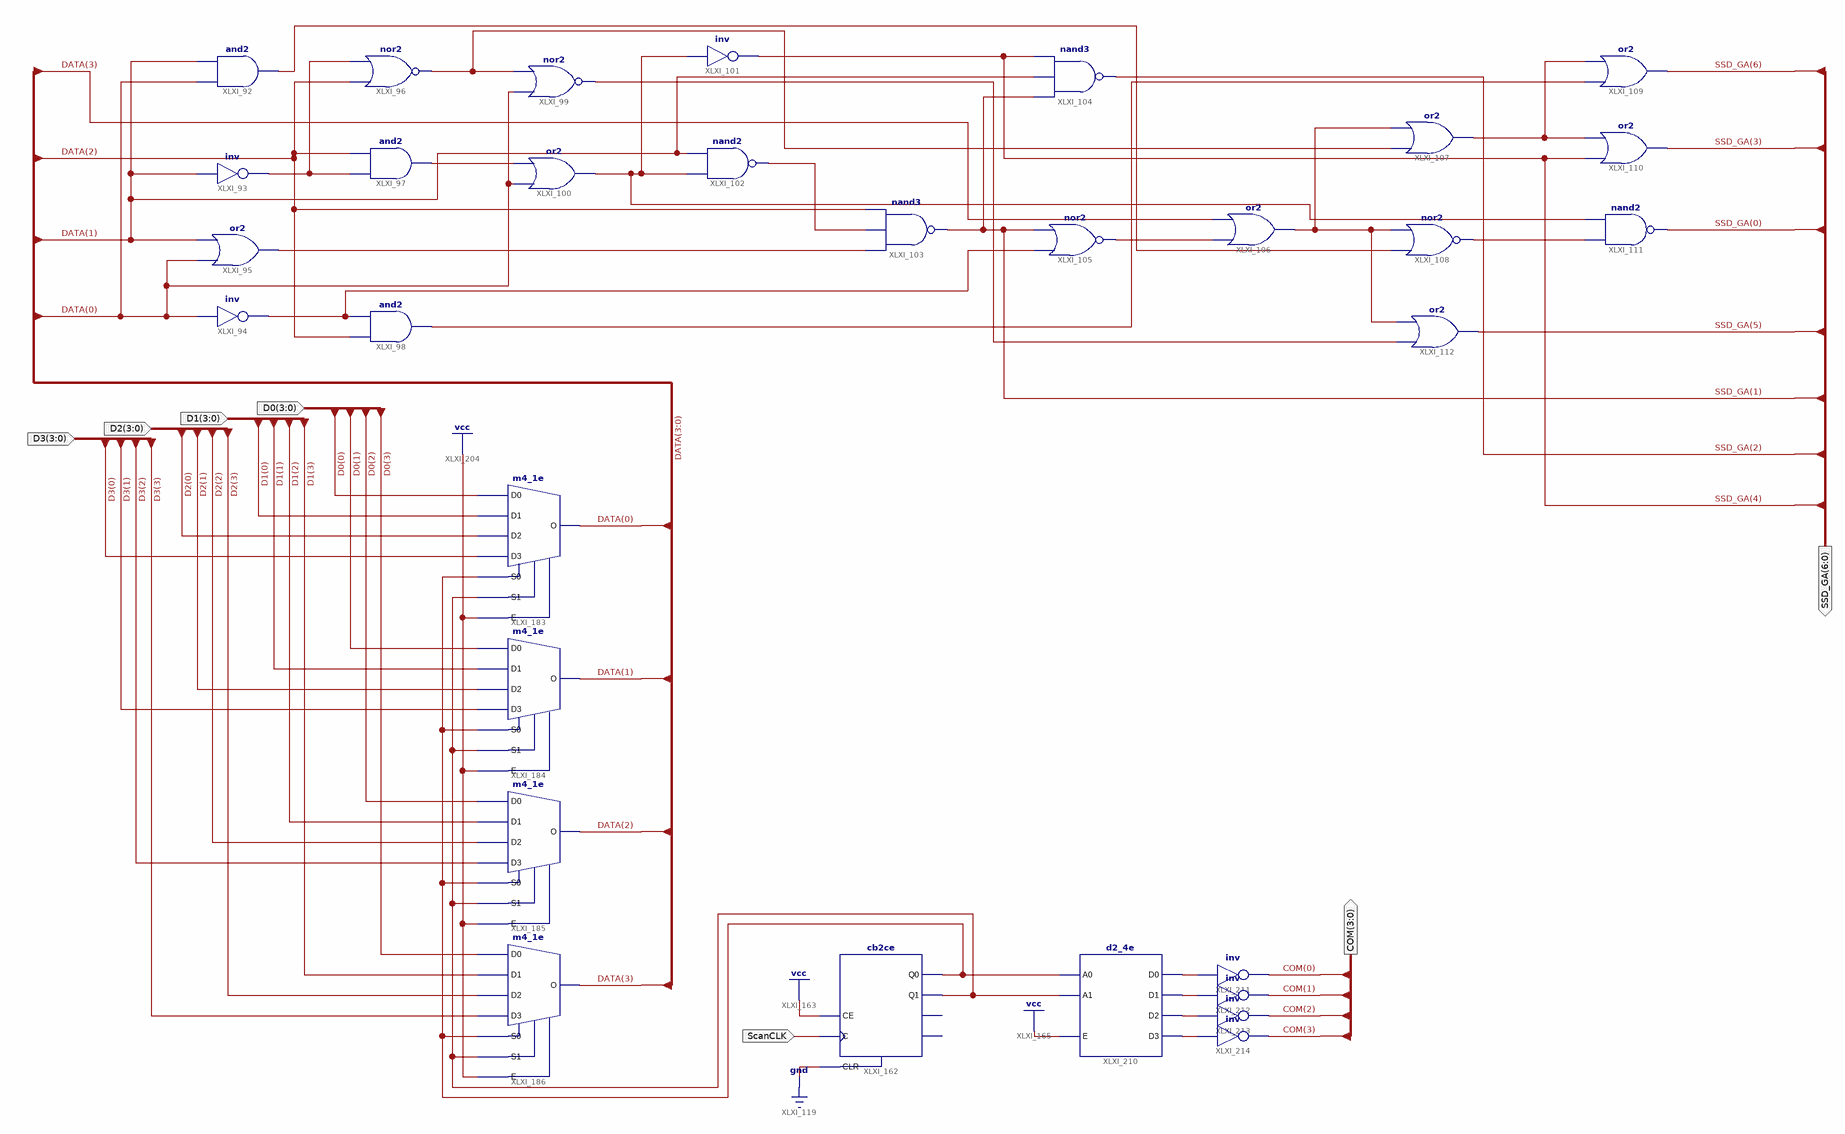
[diagram p0: schematic sheet 1]
// Xilinx ISE schematic ssd4d09b.sch (spartan6) as structural Verilog: 31 symbols, 7 ports
module ssd4d09b (
  input  [3:0] D0,
  input  [3:0] D1,
  input  [3:0] D2,
  input  [3:0] D3,
  input  ScanCLK,
  output [6:0] SSD_GA,
  output [3:0] COM
);

  wire XLXN_109, XLXN_111, XLXN_113, XLXN_114, XLXN_117, XLXN_118, XLXN_119, XLXN_125, XLXN_129, XLXN_130,
       XLXN_131, XLXN_132, XLXN_134, XLXN_135, XLXN_195, XLXN_199, XLXN_236, XLXN_237, XLXN_238, XLXN_239;
  wire [3:0] DATA;

  and XLXI_92 (XLXN_129, DATA[0], DATA[1]);
  not XLXI_93 (XLXN_109, DATA[1]);
  not XLXI_94 (XLXN_111, DATA[0]);
  or XLXI_95 (XLXN_118, DATA[0], DATA[1]);
  nor XLXI_96 (XLXN_113, DATA[2], XLXN_109);
  and XLXI_97 (XLXN_114, XLXN_109, DATA[2]);
  and XLXI_98 (XLXN_135, DATA[2], XLXN_111);
  nor XLXI_99 (XLXN_131, DATA[0], XLXN_113);
  or XLXI_100 (XLXN_117, DATA[0], XLXN_114);
  not XLXI_101 (SSD_GA[4], XLXN_117);
  nand XLXI_102 (XLXN_119, XLXN_117, DATA[1]);
  nand XLXI_103 (SSD_GA[1], XLXN_118, XLXN_119, DATA[2]);
  nand XLXI_104 (SSD_GA[2], SSD_GA[1], DATA[1], SSD_GA[4]);
  nor XLXI_105 (XLXN_125, XLXN_111, SSD_GA[1]);
  or XLXI_106 (XLXN_130, XLXN_125, DATA[3]);
  or XLXI_107 (XLXN_134, XLXN_113, XLXN_130);
  nor XLXI_108 (XLXN_132, XLXN_129, XLXN_130);
  or XLXI_109 (SSD_GA[6], XLXN_135, XLXN_134);
  or XLXI_110 (SSD_GA[3], SSD_GA[4], XLXN_134);
  nand XLXI_111 (SSD_GA[0], XLXN_132, XLXN_117);
  or XLXI_112 (SSD_GA[5], XLXN_131, XLXN_130);
  m4_1e XLXI_183 (.D0(D0[0]), .D1(D1[0]), .D2(D2[0]), .D3(D3[0]), .E(1'b1), .S0(XLXN_195), .S1(XLXN_199), .O(DATA[0]));
  m4_1e XLXI_184 (.D0(D0[1]), .D1(D1[1]), .D2(D2[1]), .D3(D3[1]), .E(1'b1), .S0(XLXN_195), .S1(XLXN_199), .O(DATA[1]));
  m4_1e XLXI_185 (.D0(D0[2]), .D1(D1[2]), .D2(D2[2]), .D3(D3[2]), .E(1'b1), .S0(XLXN_195), .S1(XLXN_199), .O(DATA[2]));
  m4_1e XLXI_186 (.D0(D0[3]), .D1(D1[3]), .D2(D2[3]), .D3(D3[3]), .E(1'b1), .S0(XLXN_195), .S1(XLXN_199), .O(DATA[3]));
  cb2ce XLXI_162 (.C(ScanCLK), .CE(1'b1), .CLR(1'b0), .Q0(XLXN_195), .Q1(XLXN_199));  // open: CEO, TC
  d2_4e XLXI_210 (.A0(XLXN_195), .A1(XLXN_199), .E(1'b1), .D0(XLXN_236), .D1(XLXN_237), .D2(XLXN_238), .D3(XLXN_239));
  not XLXI_211 (COM[0], XLXN_236);
  not XLXI_212 (COM[1], XLXN_237);
  not XLXI_213 (COM[2], XLXN_238);
  not XLXI_214 (COM[3], XLXN_239);
endmodule
